# EAGLE design fab-psoc (EAGLE 6.5.0)
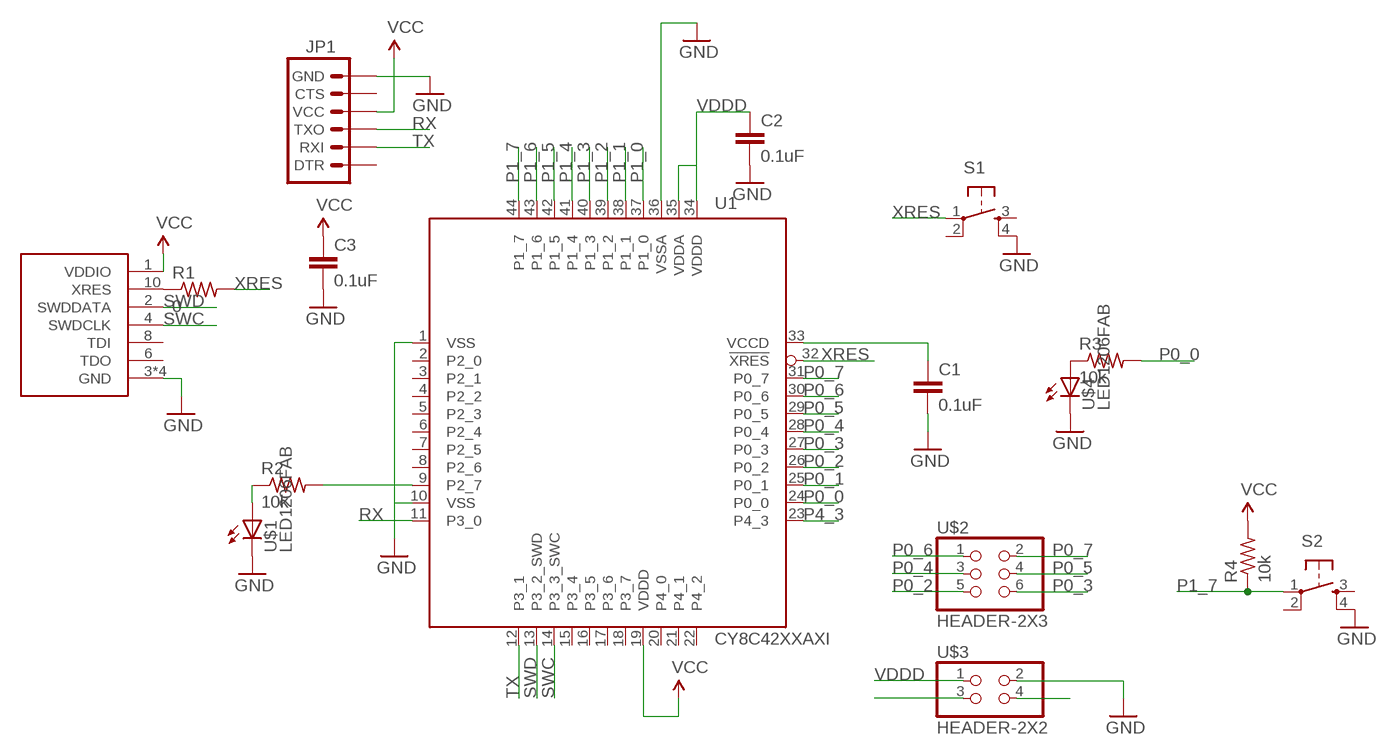
[diagram p0: schematic, sheet 1]

## Parts
C1  0.1uF  CAPACITOR1206FAB  [C1206FAB]
C2  0.1uF  CAPACITOR1206FAB  [C1206FAB]
C3  0.1uF  CAPACITOR1206FAB  [C1206FAB]
JP1  FTDI-SMD  [FTDI-SMD]
MINIPROG3  MINIPROG  [2X5SMD]
R1  0  RESISTOR1206FAB  [R1206FAB]
R2  10k  RESISTOR1206FAB  [R1206FAB]
R3  10k  RESISTOR1206FAB  [R1206FAB]
R4  10k  RESISTOR1206FAB  [R1206FAB]
S1  SWITCH  [SWITCH]
S2  SWITCH  [SWITCH]
U1  CY8C42XXAXI  [TQFP-10X10-44]
U$1  LED1206FAB  [R1206FAB]
U$2  HEADER-2X3  [2X3SMD]
U$3  HEADER-2X2  [2X2SMD]
U$4  LED1206FAB  [R1206FAB]

## Nets
GND: C1.2 C2.2 C3.2 JP1.6(GND) MINIPROG3.3(GND) MINIPROG3.5(GND) MINIPROG3.7(GND) MINIPROG3.9(GND) S1.4(S1) S2.4(S1) U1.1(VSS) U1.10(VSS) U1.36(VSSA) U$1.2(C) U$3.2 U$4.2(C)
N$1: C1.1 U1.33(VCCD)
N$2: MINIPROG3.10(XRES) R1.1
N$3: R3.1 U$4.1(A)
N$4: R2.2 U1.9(P2_7)
N$5: R2.1 U$1.1(A)
N$13: U$3.4
N$14: U$3.3
P0_0: R3.2 U1.24(P0_0)
P0_1: U1.25(P0_1)
P0_2: U1.26(P0_2) U$2.5
P0_3: U1.27(P0_3) U$2.6
P0_4: U1.28(P0_4) U$2.3
P0_5: U1.29(P0_5) U$2.4
P0_6: U1.30(P0_6) U$2.1
P0_7: U1.31(P0_7) U$2.2
P1_0: U1.37(P1_0)
P1_1: U1.38(P1_1)
P1_2: U1.39(P1_2)
P1_3: U1.40(P1_3)
P1_4: U1.41(P1_4)
P1_5: U1.42(P1_5)
P1_6: U1.43(P1_6)
P1_7: R4.1 S2.1(P) U1.44(P1_7)
P4_3: U1.23(P4_3)
RX: JP1.3(TXO) U1.11(P3_0)
SWC: MINIPROG3.4(SWDCLK) U1.14(P3_3_SWC)
SWD: MINIPROG3.2(SWDDATA) U1.13(P3_2_SWD)
TX: JP1.2(RXI) U1.12(P3_1)
VCC: C3.1 JP1.4(VCC) MINIPROG3.1(VDDIO) R4.2 U1.19(VDDD)
VDDD: C2.1 U1.34(VDDD) U1.35(VDDA) U$3.1
XRES: R1.2 S1.1(P) U1.32(!XRES)
Unconnected: JP1.1(DTR) JP1.5(CTS) MINIPROG3.6(TDO) MINIPROG3.8(TDI) S1.2(P1) S1.3(S) S2.2(P1) S2.3(S) U1.2(P2_0) U1.3(P2_1) U1.5(P2_3) U1.6(P2_4) U1.7(P2_5) U1.15(P3_4) U1.16(P3_5) U1.18(P3_7) U1.20(P4_0) U1.21(P4_1) U1.22(P4_2)

## Power pins joined to a net without a drawn wire
P2_2: U1.4(P2_2)
P2_6: U1.8(P2_6)
P3_6: U1.17(P3_6)

## Library data of the parts
C1-C3 = fab:CAPACITOR
JP1 = fab:FTDI
MINIPROG3 = fab:MINIPROG
R1 = fab:RESISTOR; VALUE: 10k
R2-R4 = fab:RESISTOR
S1 S2 = fab:SWITCH
U1 = fab:CY8C42XX
U$1 U$4 = fab:LED
U$2 = fab:HEADER-2X3
U$3 = fab:HEADER-2X2

## Board
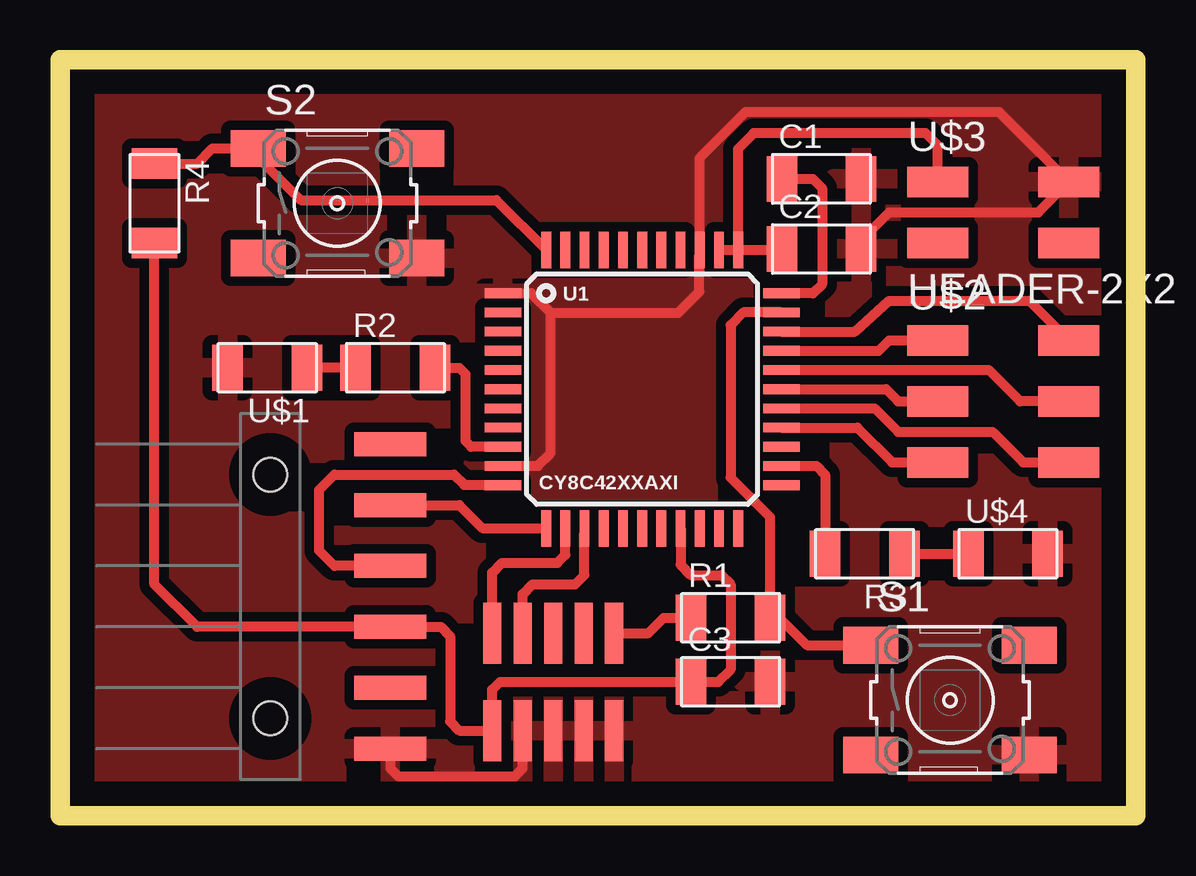
[diagram p1: board, top side]

Size 44.83 x 31.5 mm. Coordinates in mm from the lower left corner, seen from the top.
Outline: 0,0 44.83,0 44.83,31.5 0,31.5 0,0
Copper layers (1*16): Top 0.035mm / dielectric 1.5mm / Bottom 0.035mm
Design rules "fab *": minimum track width 0.3mm, minimum drill 32mil, track to track 0.315mm, track to pad 0.315mm, pad to pad 0.315mm, via to via 0.315mm, smd to smd 0.315mm, copper to edge 40mil, drill to drill 16mil, minimum pad ring 10mil, minimum via ring 8mil, stop-mask expansion 4mil, vias tented up to drill 0mil, thermal gap 16mil

### Footprints (pad centres in the part's own frame; a part is rotated, then mirrored left to right if it is on the bottom)
C1206FAB = smd 1.27 x 1.905: 1 -1.651,0; 2 1.651,0
FTDI-SMD = smd 1 x 3: 1 -6.35,5; 2 -3.81,5; 3 -1.27,5; 4 1.27,5; 5 3.81,5; 6 6.35,5 | hole 1.4: -5.08,0; 5.08,0
2X5SMD = smd 0.762 x 2.54: 1 -2.54,-2.032; 2 -2.54,2.032; 3 -1.27,-2.032; 4 -1.27,2.032; 5 0,-2.032; 6 0,2.032; 7 1.27,-2.032; 8 1.27,2.032; 9 2.54,-2.032; 10 2.54,2.032
R1206FAB = smd 1.27 x 1.905: 1 -1.651,0; 2 1.651,0
SWITCH = smd 2.286 x 1.524: 1 -3.302,2.286; 2 3.302,2.286; 3 -3.302,-2.286; 4 3.302,-2.286
TQFP-10X10-44 = smd 1.524 x 0.406: 1 -5.8,4; 2 -5.8,3.2; 3 -5.8,2.4; 4 -5.8,1.6; 5 -5.8,0.8; 6 -5.8,0; 7 -5.8,-0.8; 8 -5.8,-1.6; 9 -5.8,-2.4; 10 -5.8,-3.2; 11 -5.8,-4; 23 5.8,-4; 24 5.8,-3.2; 25 5.8,-2.4; 26 5.8,-1.6; 27 5.8,-0.8; 28 5.8,0; 29 5.8,0.8; 30 5.8,1.6; 31 5.8,2.4; 32 5.8,3.2; 33 5.8,4 | smd 0.406 x 1.524: 12 -4,-5.8; 13 -3.2,-5.8; 14 -2.4,-5.8; 15 -1.6,-5.8; 16 -0.8,-5.8; 17 0,-5.8; 18 0.8,-5.8; 19 1.6,-5.8; 20 2.4,-5.8; 21 3.2,-5.8; 22 4,-5.8; 34 4,5.8; 35 3.2,5.8; 36 2.4,5.8; 37 1.6,5.8; 38 0.8,5.8; 39 0,5.8; 40 -0.8,5.8; 41 -1.6,5.8; 42 -2.4,5.8; 43 -3.2,5.8; 44 -4,5.8
2X3SMD = smd 2.54 x 1.27: 1 -2.54,2.54; 2 2.92,2.54; 3 -2.54,0; 4 2.92,0; 5 -2.54,-2.54; 6 2.92,-2.54
2X2SMD = smd 2.54 x 1.27: 1 -2.54,1.27; 2 2.92,1.27; 3 -2.54,-1.27; 4 2.92,-1.27

### Placement (x,y rotation side)
C1  31.72,26.54 0 top
C2  31.72,23.62 0 top
C3  27.94,5.59 0 top
JP1  8.76,9.14 270 top
MINIPROG3  20.55,5.59 0 top
R1  27.94,8.26 0 top
R2  13.97,18.67 0 top
R3  33.53,10.92 180 top
R4  3.94,25.53 270 top
S1  37.08,4.83 0 top
S2  11.56,25.53 0 top
U1  24.26,17.78 0 top
U$1  8.64,18.67 180 top
U$2  39.12,17.27 0 top
U$3  39.12,25.15 0 top
U$4  39.5,10.92 0 top

### Tracks (layer width: path | path; a pad name or v marks a point on that pad's centre or on a via)
GND
  Top 0.406: U1.10 19.91,14.58 20.45,15.11 20.45,20.95 | 20.45,20.95 25.76,20.95 26.64,21.84 26.64,23.19 U1.36 26.66,27.42 28.57,29.34 39.12,29.34 U$3.2 40.77,25.15 34.54,25.15 33.38,23.98 C2.2 | U1.1 19.62,21.78 20.45,20.95 | JP1.6 13.76,1.99 14.1,1.65 18.95,1.65 19.28,1.98 MINIPROG3.3
  pour Top (isolate 0.406): 0,0 44.83,0 44.83,31.5 0,31.5
N$1
  Top 0.406: C1.1 31.37,26.54 31.75,26.16 31.75,22.15 31.37,21.77 30.07,21.77 U1.33
N$2
  Top 0.406: MINIPROG3.10 24.51,7.62 25.15,8.26 R1.1
N$3
  Top 0.406: R3.1 U$4.1
N$4
  Top 0.406: U1.9 17.13,15.38 16.89,15.62 16.89,18.41 16.64,18.67 R2.2
N$5
  Top 0.406: R2.1 U$1.1
P0_0
  Top 0.406: U1.24 31.52,14.58 31.88,14.22 R3.2
P0_2
  Top 0.406: U1.26 33.22,16.18 34.67,14.73 U$2.5
P0_3
  Top 0.406: U1.27 33.95,16.98 34.92,16 38.86,16 40.13,14.73 U$2.6
P0_4
  Top 0.406: U1.28 34.42,17.78 34.92,17.27 U$2.3
P0_5
  Top 0.406: U1.29 38.7,18.58 40,17.27 U$2.4
P0_6
  Top 0.406: U1.30 34.11,19.38 34.54,19.81 U$2.1
P0_7
  Top 0.406: U1.31 33.13,20.18 34.54,21.46 40.38,21.46 U$2.2
P1_7
  Top 0.406: U1.44 18.18,25.65 10.03,25.65 8.26,27.43 S2.1 6.35,27.81 5.71,27.18 R4.1
RX
  Top 0.406: JP1.3 11.43,10.41 10.79,11.05 10.79,13.59 11.43,14.22 16.41,14.22 16.84,13.79 18.45,13.79 U1.11
SWC
  Top 0.406: MINIPROG3.4 19.28,9.25 19.68,9.65 21.46,9.65 21.84,10.03 21.84,11.59 U1.14
SWD
  Top 0.406: MINIPROG3.2 18.01,10.13 18.41,10.54 20.73,10.54 21.06,10.87 21.06,11.6 U1.13
TX
  Top 0.406: JP1.2 16.64,12.95 17.6,11.99 20.25,11.99 U1.12
VCC
  Top 0.406: U1.19 25.86,10.46 26.29,10.03 27.56,10.03 27.94,9.65 27.94,6.1 27.43,5.59 C3.1 18.34,5.59 18.01,5.26 MINIPROG3.1 16.64,3.56 16.26,3.94 16.26,7.49 15.88,7.87 JP1.4 5.71,7.87 3.94,9.65 R4.2
VDDD
  Top 0.406: U1.35 U1.34 | U1.34 30.03,23.58 C2.1 | U$3.1 36.58,27.94 36.07,28.45 28.91,28.45 28.25,27.79 28.25,23.59 U1.34
XRES
  Top 0.406: U1.32 28.47,20.98 27.94,20.45 27.94,14.1 29.59,12.45 R1.2 29.97,8.26 31.11,7.11 S1.1